# EAGLE design STM32_ACTUADORES (EAGLE 9.6.2)
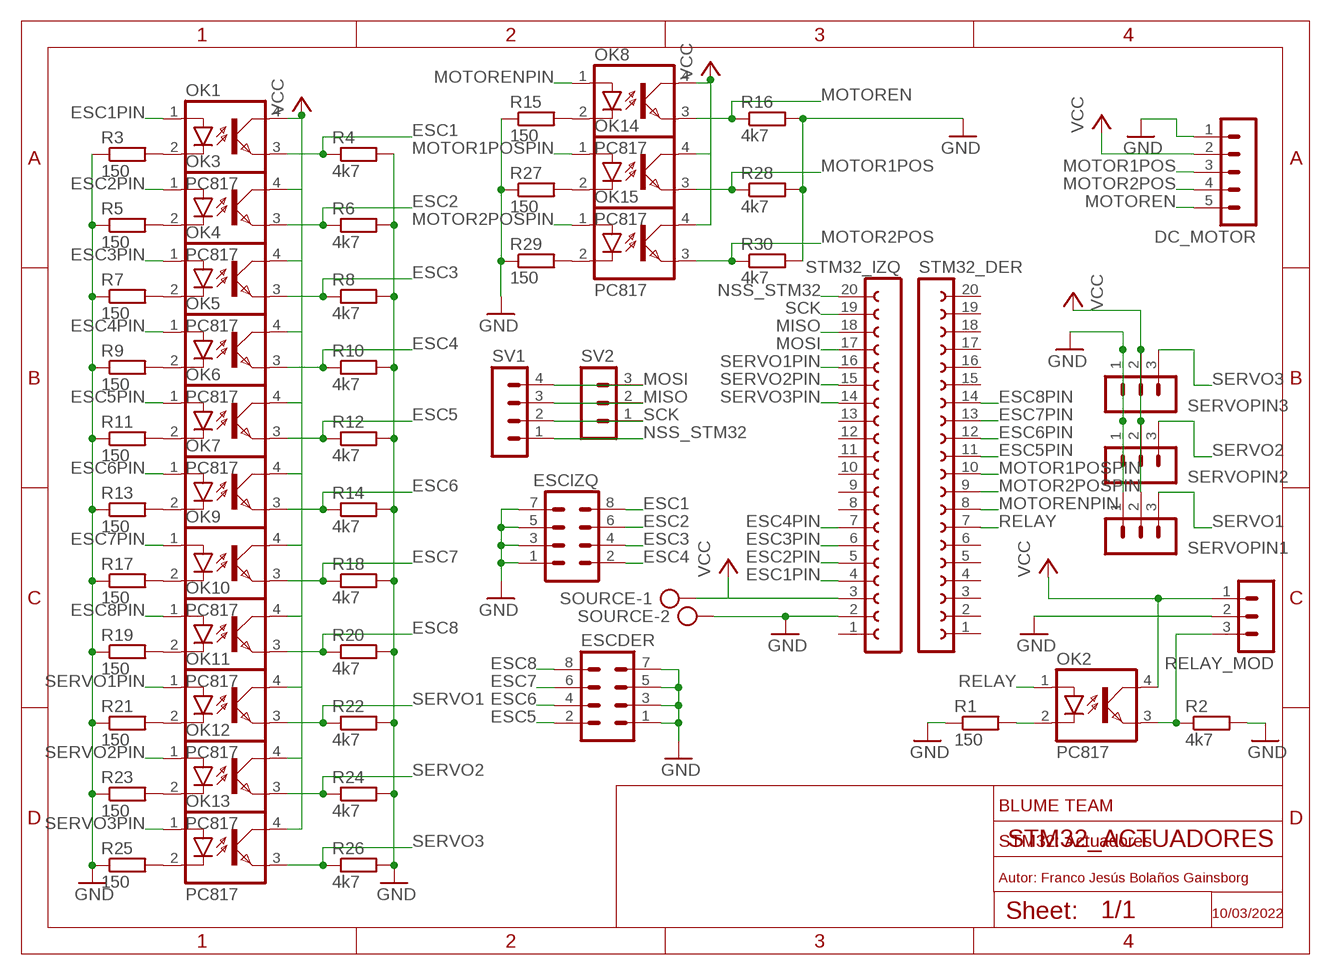
[diagram p0: schematic, sheet 1]

## Parts
DC_MOTOR  MA05-1  [MA05-1]
ESCDER  MA04-2  [MA04-2]
ESCIZQ  MA04-2  [MA04-2]
OK1  PC817  [DIL04]
OK2  PC817  [DIL04]
OK3  PC817  [DIL04]
OK4  PC817  [DIL04]
OK5  PC817  [DIL04]
OK6  PC817  [DIL04]
OK7  PC817  [DIL04]
OK8  PC817  [DIL04]
OK9  PC817  [DIL04]
OK10  PC817  [DIL04]
OK11  PC817  [DIL04]
OK12  PC817  [DIL04]
OK13  PC817  [DIL04]
OK14  PC817  [DIL04]
OK15  PC817  [DIL04]
R1  150  R-EU_0207/10  [0207/10]
R2  4k7  R-EU_0207/10  [0207/10]
R3  150  R-EU_0207/10  [0207/10]
R4  4k7  R-EU_0207/10  [0207/10]
R5  150  R-EU_0207/10  [0207/10]
R6  4k7  R-EU_0207/10  [0207/10]
R7  150  R-EU_0207/10  [0207/10]
R8  4k7  R-EU_0207/10  [0207/10]
R9  150  R-EU_0207/10  [0207/10]
R10  4k7  R-EU_0207/10  [0207/10]
R11  150  R-EU_0207/10  [0207/10]
R12  4k7  R-EU_0207/10  [0207/10]
R13  150  R-EU_0207/10  [0207/10]
R14  4k7  R-EU_0207/10  [0207/10]
R15  150  R-EU_0207/10  [0207/10]
R16  4k7  R-EU_0207/10  [0207/10]
R17  150  R-EU_0207/10  [0207/10]
R18  4k7  R-EU_0207/10  [0207/10]
R19  150  R-EU_0207/10  [0207/10]
R20  4k7  R-EU_0207/10  [0207/10]
R21  150  R-EU_0207/10  [0207/10]
R22  4k7  R-EU_0207/10  [0207/10]
R23  150  R-EU_0207/10  [0207/10]
R24  4k7  R-EU_0207/10  [0207/10]
R25  150  R-EU_0207/10  [0207/10]
R26  4k7  R-EU_0207/10  [0207/10]
R27  150  R-EU_0207/10  [0207/10]
R28  4k7  R-EU_0207/10  [0207/10]
R29  150  R-EU_0207/10  [0207/10]
R30  4k7  R-EU_0207/10  [0207/10]
RELAY_MOD  MA03-1  [MA03-1]
SERVOPIN1  MA03-1  [MA03-1]
SERVOPIN2  MA03-1  [MA03-1]
SERVOPIN3  MA03-1  [MA03-1]
SOURCE  AK300/2  [AK300/2]
STM32_DER  FE20-1  [FE20]
STM32_IZQ  FE20-1  [FE20]
SV1  MA04-1  [MA04-1]
SV2  MA03-1  [MA03-1]

## Nets
ESC1: ESCIZQ.8 OK1.3(EMIT) R4.1
ESC1PIN: OK1.1(A) STM32_IZQ.4
ESC2: ESCIZQ.6 OK3.3(EMIT) R6.1
ESC2PIN: OK3.1(A) STM32_IZQ.5
ESC3: ESCIZQ.4 OK4.3(EMIT) R8.1
ESC3PIN: OK4.1(A) STM32_IZQ.6
ESC4: ESCIZQ.2 OK5.3(EMIT) R10.1
ESC4PIN: OK5.1(A) STM32_IZQ.7
ESC5: ESCDER.2 OK6.3(EMIT) R12.1
ESC5PIN: OK6.1(A) STM32_DER.11
ESC6: ESCDER.4 OK7.3(EMIT) R14.1
ESC6PIN: OK7.1(A) STM32_DER.12
ESC7: ESCDER.6 OK9.3(EMIT) R18.1
ESC7PIN: OK9.1(A) STM32_DER.13
ESC8: ESCDER.8 OK10.3(EMIT) R20.1
ESC8PIN: OK10.1(A) STM32_DER.14
GND: DC_MOTOR.1 ESCDER.1 ESCDER.3 ESCDER.5 ESCDER.7 ESCIZQ.1 ESCIZQ.3 ESCIZQ.5 ESCIZQ.7 R1.1 R2.2 R3.1 R4.2 R5.1 R6.2 R7.1 R8.2 R9.1 R10.2 R11.1 R12.2 R13.1 R14.2 R15.1 R16.2 R17.1 R18.2 R19.1 R20.2 R21.1 R22.2 R23.1 R24.2 R25.1 R26.2 R27.1 R28.2 R29.1 R30.2 RELAY_MOD.2 SERVOPIN1.1 SERVOPIN2.1 SERVOPIN3.1 SOURCE.2 STM32_IZQ.2
MISO: STM32_IZQ.18 SV1.3 SV2.2
MOSI: STM32_IZQ.17 SV1.4 SV2.3
MOTOR1POS: DC_MOTOR.3 OK14.3(EMIT) R28.1
MOTOR1POSPIN: OK14.1(A) STM32_DER.10
MOTOR2POS: DC_MOTOR.4 OK15.3(EMIT) R30.1
MOTOR2POSPIN: OK15.1(A) STM32_DER.9
MOTOREN: DC_MOTOR.5 OK8.3(EMIT) R16.1
MOTORENPIN: OK8.1(A) STM32_DER.8
N$1: OK1.2(C) R3.2
N$2: OK2.2(C) R1.2
N$3: OK2.3(EMIT) R2.1 RELAY_MOD.3
N$4: OK8.2(C) R15.2
N$5: OK14.2(C) R27.2
N$6: OK3.2(C) R5.2
N$7: OK15.2(C) R29.2
N$9: OK13.2(C) R25.2
N$11: OK4.2(C) R7.2
N$14: OK5.2(C) R9.2
N$17: OK6.2(C) R11.2
N$20: OK7.2(C) R13.2
N$26: OK9.2(C) R17.2
N$29: OK10.2(C) R19.2
N$32: OK11.2(C) R21.2
N$35: OK12.2(C) R23.2
NSS_STM32: STM32_IZQ.20 SV1.1
RELAY: OK2.1(A) STM32_DER.7
SCK: STM32_IZQ.19 SV1.2 SV2.1
SERVO1: OK11.3(EMIT) R22.1 SERVOPIN1.3
SERVO1PIN: OK11.1(A) STM32_IZQ.16
SERVO2: OK12.3(EMIT) R24.1 SERVOPIN2.3
SERVO2PIN: OK12.1(A) STM32_IZQ.15
SERVO3: OK13.3(EMIT) R26.1 SERVOPIN3.3
SERVO3PIN: OK13.1(A) STM32_IZQ.14
VCC: DC_MOTOR.2 OK1.4(COL) OK2.4(COL) OK3.4(COL) OK4.4(COL) OK5.4(COL) OK6.4(COL) OK7.4(COL) OK8.4(COL) OK9.4(COL) OK10.4(COL) OK11.4(COL) OK12.4(COL) OK13.4(COL) OK14.4(COL) OK15.4(COL) RELAY_MOD.1 SERVOPIN1.2 SERVOPIN2.2 SERVOPIN3.2 SOURCE.1 STM32_IZQ.3
Unconnected: STM32_DER.1 STM32_DER.2 STM32_DER.3 STM32_DER.4 STM32_DER.5 STM32_DER.6 STM32_DER.15 STM32_DER.16 STM32_DER.17 STM32_DER.18 STM32_DER.19 STM32_DER.20 STM32_IZQ.1 STM32_IZQ.8 STM32_IZQ.9 STM32_IZQ.10 STM32_IZQ.11 STM32_IZQ.12 STM32_IZQ.13

## Notes on the sheet
- BLUME TEAM
- STM32: Actuadores
- Autor: Franco Jesús Bolaños Gainsborg
- 10/03/2022

## Library data of the parts
DC_MOTOR = con-lstb:MA05-1: PIN HEADER; OC_FARNELL: unknown; OC_NEWARK: unknown
ESCDER ESCIZQ = con-lstb:MA04-2: PIN HEADER; OC_FARNELL: unknown; OC_NEWARK: unknown
OK1-OK15 = optocoupler:PC817: SHARP OPTO COUPLER; MPN: PC817X4J000F; OC_FARNELL: 9707727; OC_NEWARK: 97K7059
R1-R30 = rcl:R-EU_: RESISTOR, European symbol; SPICEPREFIX: R
RELAY_MOD SERVOPIN1-SERVOPIN3 SV2 = con-lstb:MA03-1: PIN HEADER; OC_FARNELL: unknown; OC_NEWARK: unknown
SOURCE = con-ptr500:AK300/2: CONNECTOR; OC_FARNELL: unknown; OC_NEWARK: unknown
STM32_DER STM32_IZQ = con-lsta:FE20-1: FEMALE HEADER; OC_FARNELL: unknown; OC_NEWARK: unknown
SV1 = con-lstb:MA04-1: PIN HEADER; OC_FARNELL: unknown; OC_NEWARK: unknown

## Board
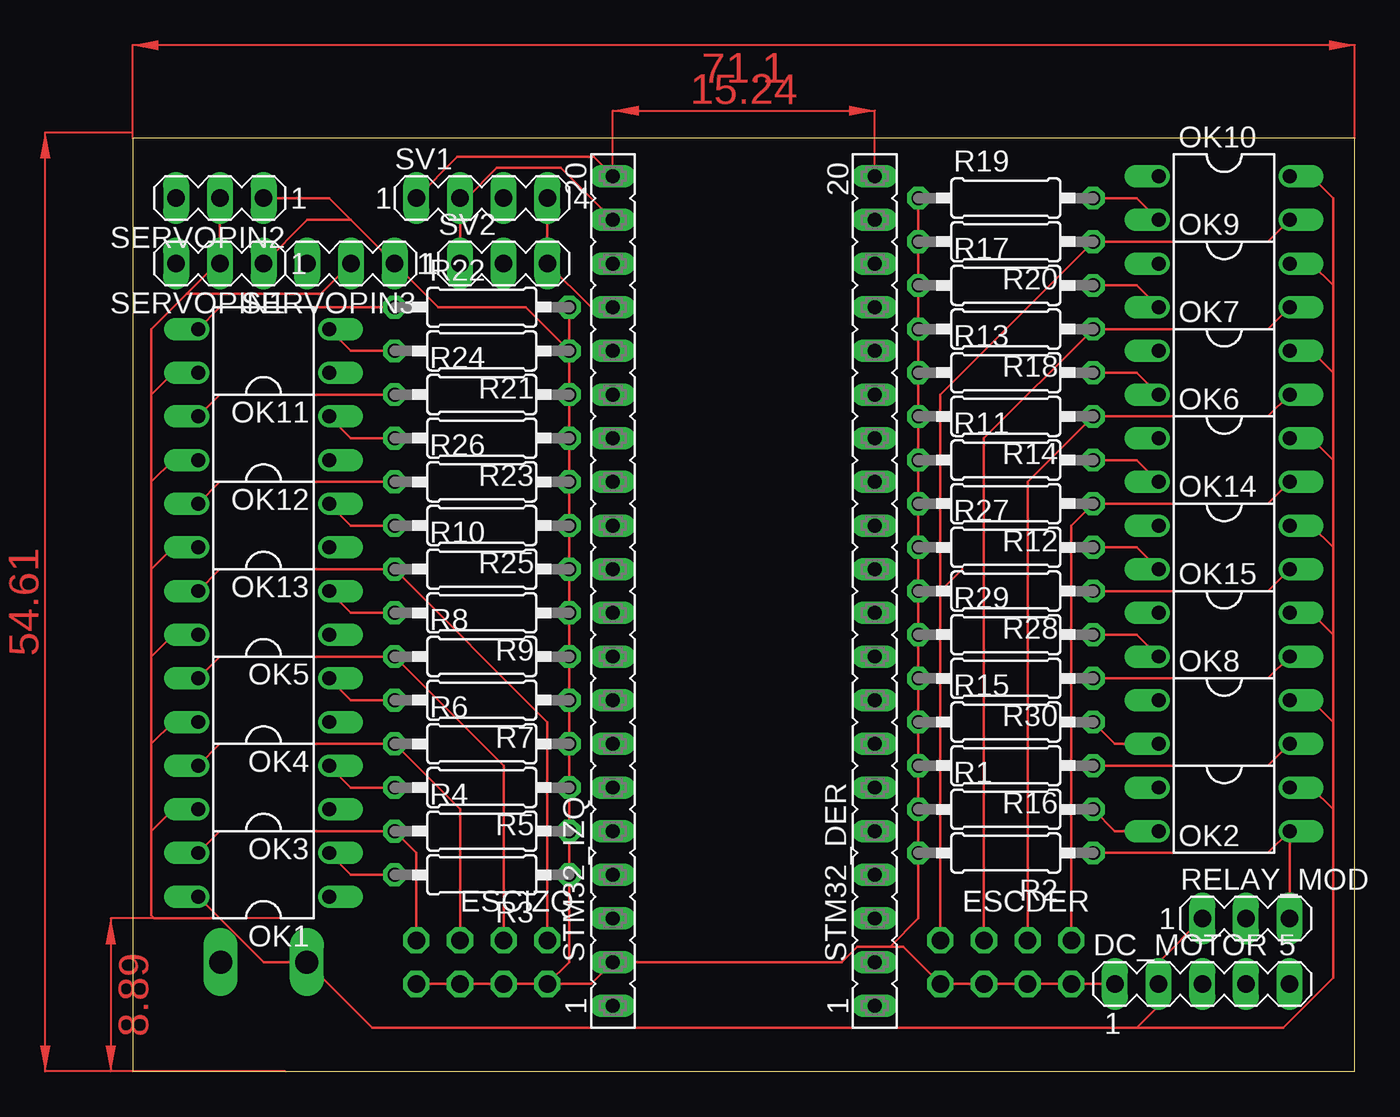
[diagram p1: board, top side]
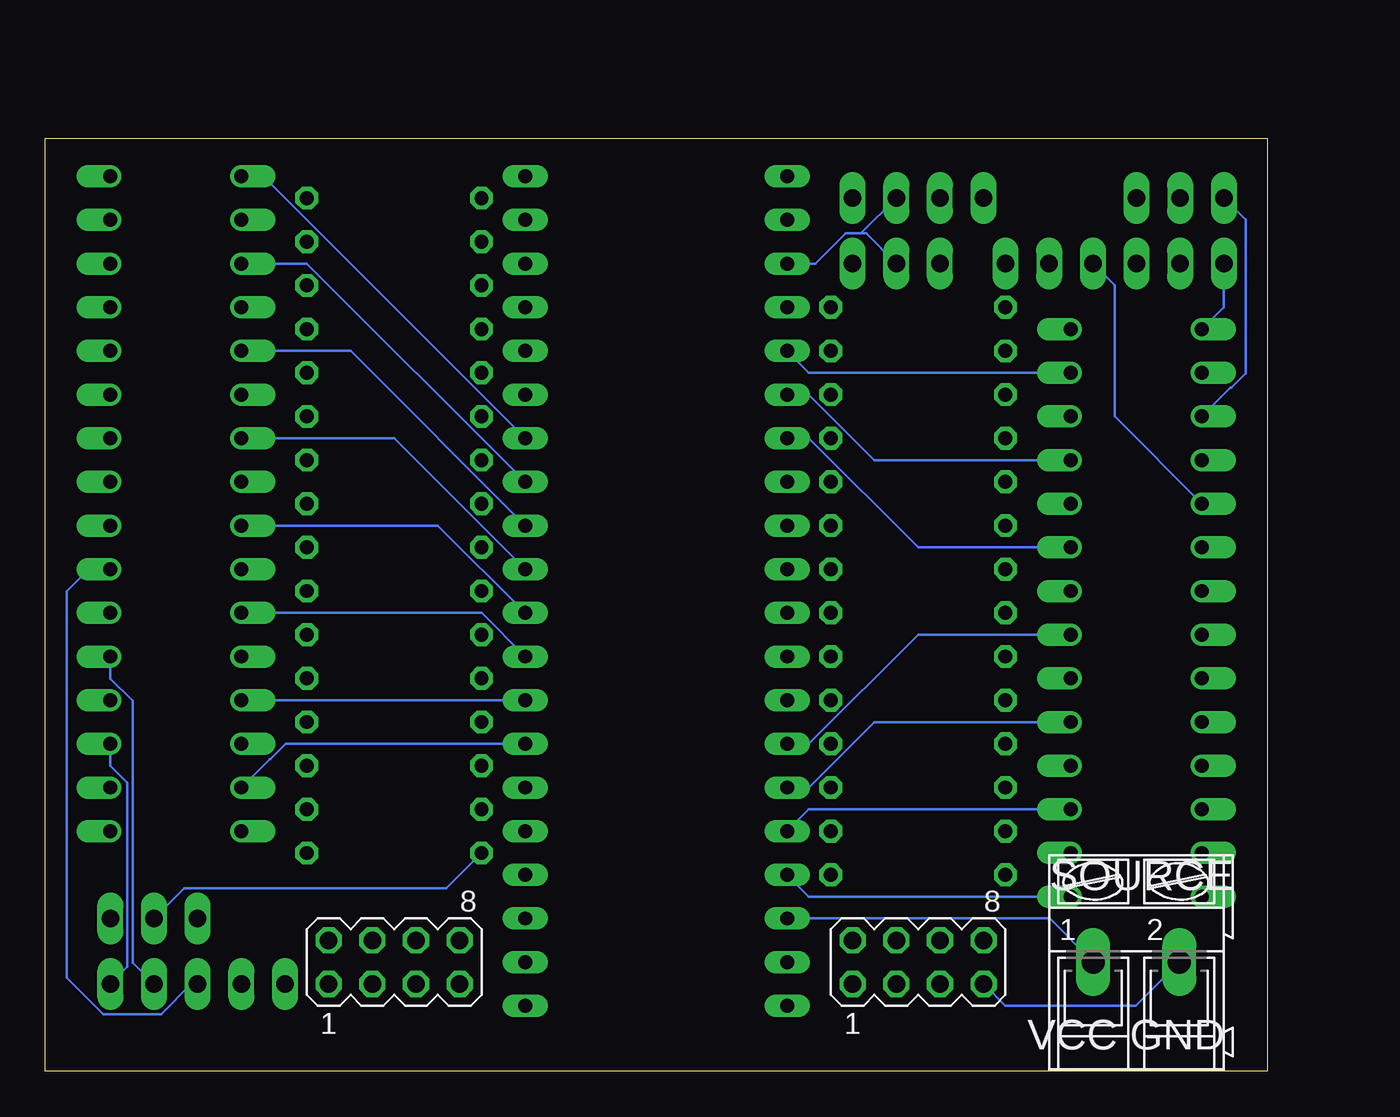
[diagram p2: board, bottom side, seen from below]

Size 71.1 x 54.28 mm. Coordinates in mm from the lower left corner, seen from the top.
Outline: 0,0 71.1,0 71.1,54.28 0,54.28 0,0
Copper layers (1*16): Top 0.035mm / dielectric 1.5mm / Bottom 0.035mm
Design rules "default": minimum track width 6mil, minimum drill 0.35mm, track to track 6mil, track to pad 6mil, pad to pad 6mil, via to via 6mil, smd to smd 6mil, copper to edge 40mil, drill to drill 6mil, minimum pad ring 10mil, minimum via ring 8mil, stop-mask expansion 4mil, vias tented up to drill 0mil, thermal gap 10mil

### Footprints (pad centres in the part's own frame; a part is rotated, then mirrored left to right if it is on the bottom)
MA05-1 = drill 1.016 long: 1 -5.08,0; 2 -2.54,0; 3 0,0; 4 2.54,0; 5 5.08,0
MA04-2 = drill 1.016 octagon: 1 -3.81,-1.27; 2 -3.81,1.27; 3 -1.27,-1.27; 4 -1.27,1.27; 5 1.27,-1.27; 6 1.27,1.27; 7 3.81,-1.27; 8 3.81,1.27
DIL04 = drill 0.813 offset: 1 -1.27,-3.81; 2 1.27,-3.81; 3 1.27,3.81; 4 -1.27,3.81
0207/10 = drill 0.813 octagon: 1 -5.08,0; 2 5.08,0
MA03-1 = drill 1.016 long: 1 -2.54,0; 2 0,0; 3 2.54,0
AK300/2 = drill 1.321 long: 1 -2.515,0; 2 2.489,0
FE20 = drill 0.813 long: 1 -24.13,0; 2 -21.59,0; 3 -19.05,0; 4 -16.51,0; 5 -13.97,0; 6 -11.43,0; 7 -8.89,0; 8 -6.35,0; 9 -3.81,0; 10 -1.27,0; 11 1.27,0; 12 3.81,0; 13 6.35,0; 14 8.89,0; 15 11.43,0; 16 13.97,0; 17 16.51,0; 18 19.05,0; 19 21.59,0; 20 24.13,0
MA04-1 = drill 1.016 long: 1 -3.81,0; 2 -1.27,0; 3 1.27,0; 4 3.81,0

### Placement (x,y rotation side)
DC_MOTOR  62.23,5.08 0 top
ESCDER  50.8,6.35 0 bottom
ESCIZQ  20.32,6.35 0 bottom
OK1  7.62,11.43 90 top
OK2  63.5,15.24 270 top
OK3  7.62,16.51 90 top
OK4  7.62,21.59 90 top
OK5  7.62,26.67 90 top
OK6  63.5,35.56 270 top
OK7  63.5,40.64 270 top
OK8  63.5,20.32 270 top
OK9  63.5,45.72 270 top
OK10  63.5,50.8 270 top
OK11  7.62,41.91 90 top
OK12  7.62,36.83 90 top
OK13  7.62,31.75 90 top
OK14  63.5,30.48 270 top
OK15  63.5,25.4 270 top
R1  50.8,15.24 0 top
R2  50.8,12.7 180 top
R3  20.32,11.43 180 top
R4  20.32,13.97 0 top
R5  20.32,16.51 180 top
R6  20.32,19.05 0 top
R7  20.32,21.59 180 top
R8  20.32,24.13 0 top
R9  20.32,26.67 180 top
R10  20.32,29.21 0 top
R11  50.8,35.56 0 top
R12  50.8,33.02 180 top
R13  50.8,40.64 0 top
R14  50.8,38.1 180 top
R15  50.8,20.32 0 top
R16  50.8,17.78 180 top
R17  50.8,45.72 0 top
R18  50.8,43.18 180 top
R19  50.8,50.8 0 top
R20  50.8,48.26 180 top
R21  20.32,41.91 180 top
R22  20.32,44.45 0 top
R23  20.32,36.83 180 top
R24  20.32,39.37 0 top
R25  20.32,31.75 180 top
R26  20.32,34.29 0 top
R27  50.8,30.48 0 top
R28  50.8,27.94 180 top
R29  50.8,25.4 0 top
R30  50.8,22.86 180 top
RELAY_MOD  64.77,8.89 0 top
SERVOPIN1  5.08,46.99 180 top
SERVOPIN2  5.08,50.8 180 top
SERVOPIN3  12.7,46.99 180 top
SOURCE  7.62,6.35 0 bottom
STM32_DER  43.18,27.94 90 top
STM32_IZQ  27.94,27.94 90 top
SV1  20.32,50.8 0 top
SV2  21.59,46.99 0 top

### Tracks (layer width: path | path; a pad name or v marks a point on that pad's centre or on a via)
ESC1
  Top 0.152: 2.54,12.7 OK1.3 5.08,13.97 R4.1 16.51,12.7 ESCIZQ.8
ESC1PIN
  Bottom 0.152: OK1.1 26.67,10.16 STM32_IZQ.4
ESC2
  Top 0.152: OK3.3 5.08,19.05 R6.1 19.05,15.24 ESCIZQ.6
ESC2PIN
  Bottom 0.152: OK3.1 26.67,15.24 STM32_IZQ.5
ESC3
  Top 0.152: OK4.3 5.08,24.13 R8.1 21.59,17.78 ESCIZQ.4
ESC3PIN
  Bottom 0.152: OK4.1 22.86,20.32 26.67,16.51 STM32_IZQ.6
ESC4
  Top 0.152: 2.54,27.94 OK5.3 5.08,29.21 R10.1 24.13,20.32 ESCIZQ.2
ESC4PIN
  Bottom 0.152: OK5.1 20.32,25.4 26.67,19.05 STM32_IZQ.7
ESC5
  Top 0.152: 68.58,34.29 OK6.3 66.04,33.02 R12.1 54.61,31.75 ESCDER.2
ESC5PIN
  Bottom 0.152: STM32_DER.11 50.8,36.83 OK6.1
ESC6
  Top 0.152: OK7.3 66.04,38.1 R14.1 52.07,34.29 ESCDER.4
ESC6PIN
  Bottom 0.152: STM32_DER.12 53.34,41.91 OK7.1
ESC7
  Top 0.152: OK9.3 66.04,43.18 R18.1 49.53,36.83 ESCDER.6
ESC7PIN
  Bottom 0.152: STM32_DER.13 55.88,46.99 OK9.1
ESC8
  Top 0.152: 68.58,49.53 OK10.3 66.04,48.26 R20.1 46.99,39.37 46.99,27.94 | ESCDER.8 46.99,27.94 | 48.26,29.21 46.99,27.94
ESC8PIN
  Bottom 0.152: STM32_DER.14 58.42,52.07 OK10.1
GND
  Top 0.152: R16.2 R29.1 R30.2 | R19.1 R20.2 R17.1 R18.2 R13.1 R14.2 R11.1 R12.2 R27.1 R28.2 R15.1 R16.2 | R16.2 R1.1 R2.2 45.72,8.89 44.07,7.24 | DC_MOTOR.1 ESCDER.1 ESCDER.3 ESCDER.5 ESCDER.7 44.83,7.24 44.07,7.24 | 12.7,49.53 SERVOPIN3.1 17.78,44.45 22.86,44.45 R21.1 | 12.7,49.53 10.16,49.53 SERVOPIN1.1 | R22.2 R21.1 | R21.1 R24.2 R23.1 R26.2 R25.1 R10.2 R9.1 R8.2 R7.1 R6.2 R5.1 R4.2 R3.1 25.4,6.35 ESCIZQ.1 | ESCIZQ.7 ESCIZQ.5 ESCIZQ.3 ESCIZQ.1 | ESCIZQ.1 26.67,5.08 STM32_IZQ.2 41.26,6.35 42.15,7.24 44.07,7.24 | SERVOPIN2.1 11.43,50.8 12.7,49.53
  Bottom 0.152: RELAY_MOD.2 63.02,10.64 47.78,10.64 R2.2 | SOURCE.2 7.67,3.81 15.24,3.81 ESCIZQ.7
MISO
  Bottom 0.152: 23.65,48.74 SV1.3 | 23.65,48.74 24.54,48.74 26.29,46.99 STM32_IZQ.18 | SV2.2 23.34,48.74 23.65,48.74
MOSI
  Top 0.152: STM32_IZQ.17 26.67,44.45 SV2.3 SV1.4
MOTOR1POS
  Top 0.152: OK14.3 66.04,27.94 R28.1
  Bottom 0.152: DC_MOTOR.3 62.61,5.08 64.36,3.33 67.72,3.33 69.85,5.46 69.85,27.94 68.58,29.21 OK14.3
MOTOR1POSPIN
  Bottom 0.152: STM32_DER.10 48.26,31.75 OK14.1
MOTOR2POS
  Top 0.152: OK15.3 66.04,22.86 R30.1
  Bottom 0.152: OK15.3 67.31,22.85 66.02,21.55 66.02,6.33 DC_MOTOR.4
MOTOR2POSPIN
  Bottom 0.152: STM32_DER.9 45.72,26.67 OK15.1
MOTOREN
  Top 0.152: OK8.3 66.04,17.78 R16.1
  Bottom 0.152: OK8.3 67.31,17.77 66.32,16.78 66.32,6.07 DC_MOTOR.5
MOTORENPIN
  Bottom 0.152: STM32_DER.8 OK8.1
N$1
  Top 0.152: R3.2 12.7,11.43 OK1.2
N$2
  Top 0.152: R1.2 57.15,13.97 OK2.2
N$3
  Top 0.152: R2.1 66.04,12.7 OK2.3 RELAY_MOD.3
N$4
  Top 0.152: OK8.2 57.15,19.05 R15.2
N$5
  Top 0.152: R27.2 58.42,30.48 OK14.2
N$6
  Top 0.152: R5.2 12.7,16.51 OK3.2
N$7
  Top 0.152: OK15.2 58.42,25.4 R29.2
N$9
  Top 0.152: R25.2 12.7,31.75 OK13.2
N$11
  Top 0.152: R7.2 12.7,21.59 OK4.2
N$14
  Top 0.152: R9.2 12.7,26.67 OK5.2
N$17
  Top 0.152: R11.2 58.42,35.56 OK6.2
N$20
  Top 0.152: R13.2 58.42,40.64 OK7.2
N$26
  Top 0.152: R17.2 58.42,45.72 OK9.2
N$29
  Top 0.152: R19.2 58.42,50.8 OK10.2
N$32
  Top 0.152: R21.2 12.7,41.91 OK11.2
N$35
  Top 0.152: R23.2 12.7,36.83 OK12.2
NSS_STM32
  Top 0.152: STM32_IZQ.20 26.82,53.19 18.9,53.19 SV1.1
RELAY
  Bottom 0.152: OK2.1 58.04,18.16 58,18.16 57.11,19.05 STM32_DER.7
SCK
  Top 0.152: SV2.1 SV1.2 19.43,50.8 21.18,52.55 24.92,52.55 STM32_IZQ.19
SERVO1
  Top 0.152: R22.1 5.08,44.45 OK11.3
  Bottom 0.152: OK11.3 2.54,44.45 SERVOPIN1.3
SERVO1PIN
  Bottom 0.152: OK11.1 26.67,40.64 STM32_IZQ.16
SERVO2
  Top 0.152: R24.1 5.08,39.37 OK12.3
  Bottom 0.152: OK12.3 2.16,39.75 2.12,39.75 1.27,40.6 1.27,49.53 SERVOPIN2.3
SERVO2PIN
  Bottom 0.152: OK12.1 22.86,35.56 26.67,39.37 STM32_IZQ.15
SERVO3
  Top 0.152: R26.1 5.08,34.29 OK13.3
  Bottom 0.152: OK13.3 8.89,38.1 8.89,45.72 SERVOPIN3.3
SERVO3PIN
  Bottom 0.152: OK13.1 20.32,30.48 26.67,36.83 STM32_IZQ.14
VCC
  Top 0.152: 69.85,45.72 69.85,40.64 | 69.85,40.64 69.85,35.56 | 69.85,35.56 69.85,30.48 | 69.85,30.48 69.85,25.4 | 69.85,25.4 69.85,20.32 | 69.85,20.32 69.85,15.24 | OK2.4 68.58,16.51 69.85,15.24 | OK8.4 68.58,21.59 69.85,20.32 | OK15.4 68.58,26.67 69.85,25.4 | OK14.4 68.58,31.75 69.85,30.48 | OK6.4 68.58,36.83 69.85,35.56 | OK7.4 68.58,41.91 69.85,40.64 | OK9.4 68.58,46.99 69.85,45.72 | OK10.4 68.58,52.07 69.85,50.8 69.85,45.72 | RELAY_MOD.1 59.69,6.35 DC_MOTOR.2 59.69,3.81 58.42,2.54 | 58.42,2.54 66.93,2.54 69.85,5.46 69.85,15.24 | 5.08,8.89 7.62,6.35 SOURCE.1 13.95,2.54 58.42,2.54 | 5.08,8.89 1.27,8.89 1.09,9.07 1.09,13.97 | OK1.4 5.08,8.89 | 1.09,13.97 1.09,19.05 | 1.09,19.05 1.09,24.13 | 1.09,24.13 1.09,29.21 | 1.09,29.21 1.09,34.29 | 1.09,34.29 1.09,39.37 | 1.09,34.29 2.36,35.56 OK12.4 | 1.09,29.21 2.36,30.48 OK13.4 | 1.09,24.13 2.36,25.4 OK5.4 | 1.09,19.05 2.36,20.32 OK4.4 | 1.09,13.97 2.36,15.24 OK3.4 | 1.09,39.37 2.36,40.64 OK11.4 | 1.09,39.37 1.09,43.18 3.15,45.24 | 3.15,45.24 4.9,46.99 SERVOPIN1.2 SERVOPIN2.2 | SERVOPIN3.2 10.95,45.24 3.15,45.24
  Bottom 0.152: SOURCE.1 12.68,8.89 STM32_IZQ.3
(copper drawn outside any net)
  shapes: Top area x4

### Text on the board
bNames: VCC GND